# Altium schematic sheet Top.SchDoc: LED Ring Potentiometer
size A4; DrawnBy: JHD; DocumentNumber: 1; Revision: 1.0; SheetNumber: 1; SheetTotal: 1
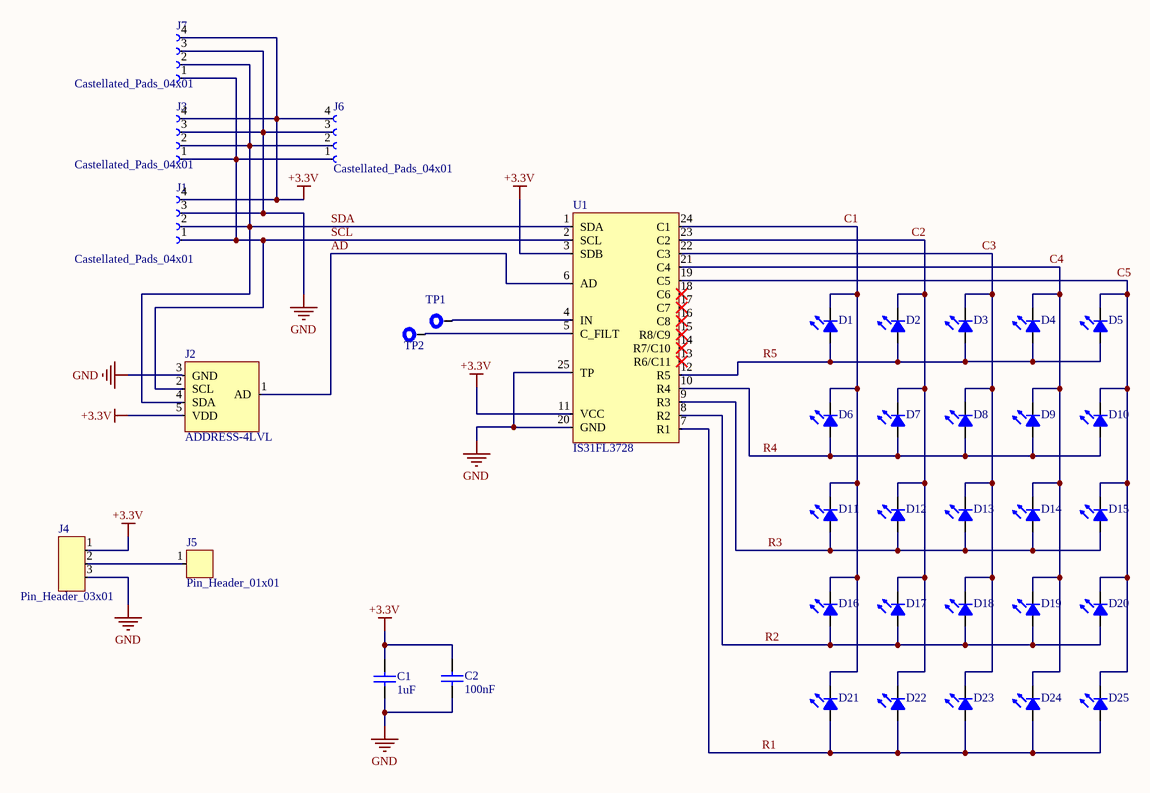
[diagram p0: Top.SchDoc]

## Parts
C1  value 1uF  [CAP_0603]  (hidden comment: CAP)
C2  value 100nF  [CAP_0603]  (hidden comment: CAP)
D1  LED  [LED_0805]  (value not drawn)
D2  LED  [LED_0805]  (value not drawn)
D3  LED  [LED_0805]  (value not drawn)
D4  LED  [LED_0805]  (value not drawn)
D5  LED  [LED_0805]  (value not drawn)
D6  LED  [LED_0805]  (value not drawn)
D7  LED  [LED_0805]  (value not drawn)
D8  LED  [LED_0805]  (value not drawn)
D9  LED  [LED_0805]  (value not drawn)
D10  LED  [LED_0805]  (value not drawn)
D11  LED  [LED_0805]  (value not drawn)
D12  LED  [LED_0805]  (value not drawn)
D13  LED  [LED_0805]  (value not drawn)
D14  LED  [LED_0805]  (value not drawn)
D15  LED  [LED_0805]  (value not drawn)
D16  LED  [LED_0805]  (value not drawn)
D17  LED  [LED_0805]  (value not drawn)
D18  LED  [LED_0805]  (value not drawn)
D19  LED  [LED_0805]  (value not drawn)
D20  LED  [LED_0805]  (value not drawn)
D21  LED  [LED_0805]  (value not drawn)
D22  LED  [LED_0805]  (value not drawn)
D23  LED  [LED_0805]  (value not drawn)
D24  LED  [LED_0805]  (value not drawn)
D25  LED  [LED_0805]  (value not drawn)
J1  Castellated_Pads_04x01  [04X01_Castellated_Pad_1MM]
J2  ADDRESS-4LVL  [ADDRESS-4LVL]
J3  Castellated_Pads_04x01  [04X01_Castellated_Pad_1MM]
J4  Pin_Header_03x01  [03x01_Header_5mm_MAL_DOWN]
J5  Pin_Header_01x01  [01x01_Header_2.54mm_MAL]
J6  Castellated_Pads_04x01  [04X01_Castellated_Pad_1MM]
J7  Castellated_Pads_04x01  [04X01_Castellated_Pad_1MM]
TP1  Testpoint 2mm  [TESTPOINT]  (value not drawn)
TP2  Testpoint 2mm  [TESTPOINT]  (value not drawn)
U1  IS31FL3728  [QFN50P395X400X80_HS-25N]

## Nets
+3.3V: C1.2 C2.2 J1.4 J2.5(VDD) J3.4 J4.1 J6.4 J7.4 U1.3(SDB) U1.11(VCC)
GND: C1.1 C2.1 J1.3 J2.3(GND) J3.3 J4.3 J6.3 J7.3 U1.20(GND) U1.25(TP)
AD: J2.1(AD) U1.6(AD)
C1: D1.1(K) D6.1(K) D11.1(K) D16.1(K) D21.1(K) U1.24(C1)
C2: D2.1(K) D7.1(K) D12.1(K) D17.1(K) D22.1(K) U1.23(C2)
C3: D3.1(K) D8.1(K) D13.1(K) D18.1(K) D23.1(K) U1.22(C3)
C4: D4.1(K) D9.1(K) D14.1(K) D19.1(K) D24.1(K) U1.21(C4)
C5: D5.1(K) D10.1(K) D15.1(K) D20.1(K) D25.1(K) U1.19(C5)
R1: D21.2(A) D22.2(A) D23.2(A) D24.2(A) D25.2(A) U1.7(R1)
R2: D16.2(A) D17.2(A) D18.2(A) D19.2(A) D20.2(A) U1.8(R2)
R3: D11.2(A) D12.2(A) D13.2(A) D14.2(A) D15.2(A) U1.9(R3)
R4: D6.2(A) D7.2(A) D8.2(A) D9.2(A) D10.2(A) U1.10(R4)
SCL: J1.1 J2.2(SCL) J3.1 J6.1 J7.1 U1.2(SCL)
SDA: J1.2 J2.4(SDA) J3.2 J6.2 J7.2 U1.1(SDA)
NetD1_2: D1.2(A) D2.2(A) D3.2(A) D4.2(A) D5.2(A) U1.12(R5)
NetJ4_2: J4.2 J5.1
NetTP1_1: TP1.1 U1.4(IN)
NetTP2_1: TP2.1 U1.5(C_FILT)

Not connected (* = marked no-connect by the designer): U1 13(R6/C11)* 14(R7/C10)* 15(R8/C9)* 16(C8)* 17(C7)* 18(C6)*

## Notes on the sheet
- Title
- Size:
- Date:
- A4
- Number:
- Time:
- Revision:
- Sheet
- of
- Drawn by:
- File:

## Notes on the sheet
- Labels drawn without touching a wire or pin: R5

## Library data of the parts
D1-D25 = LED: Manufacturer Number: SMLMN2WB1CW1; Manufacturer: ROHM Semiconductor; Distributor: *; Distributor Number: *
U1 = IS31FL3728: 8x8 IIC Led Driver; Manufacturer: ISSI; Distributor: *; Distributor Number: *; Manufacturer Number: IS31FL3728
C1 C2 = CAP: Manufacturer Number: *; Manufacturer: *; Distributor: *; Distributor Number: *
J4 = Pin_Header_03x01: Manufacturer Number: *; Manufacturer: *; Distributor: *; Distributor Number: *